# Altium schematic sheet Power Distribution - Load Switchs and Connectos.SchDoc: Title
size B; Organization: Midnight Sun Solar Rayce Car Team; Address1: University of Waterloo; Address2: 200 University Ave W; Address3: Waterloo, ON, Canada; Address4: N2L 3E9; Website: www.uwmidsun.com; ProjectName: ProjectName
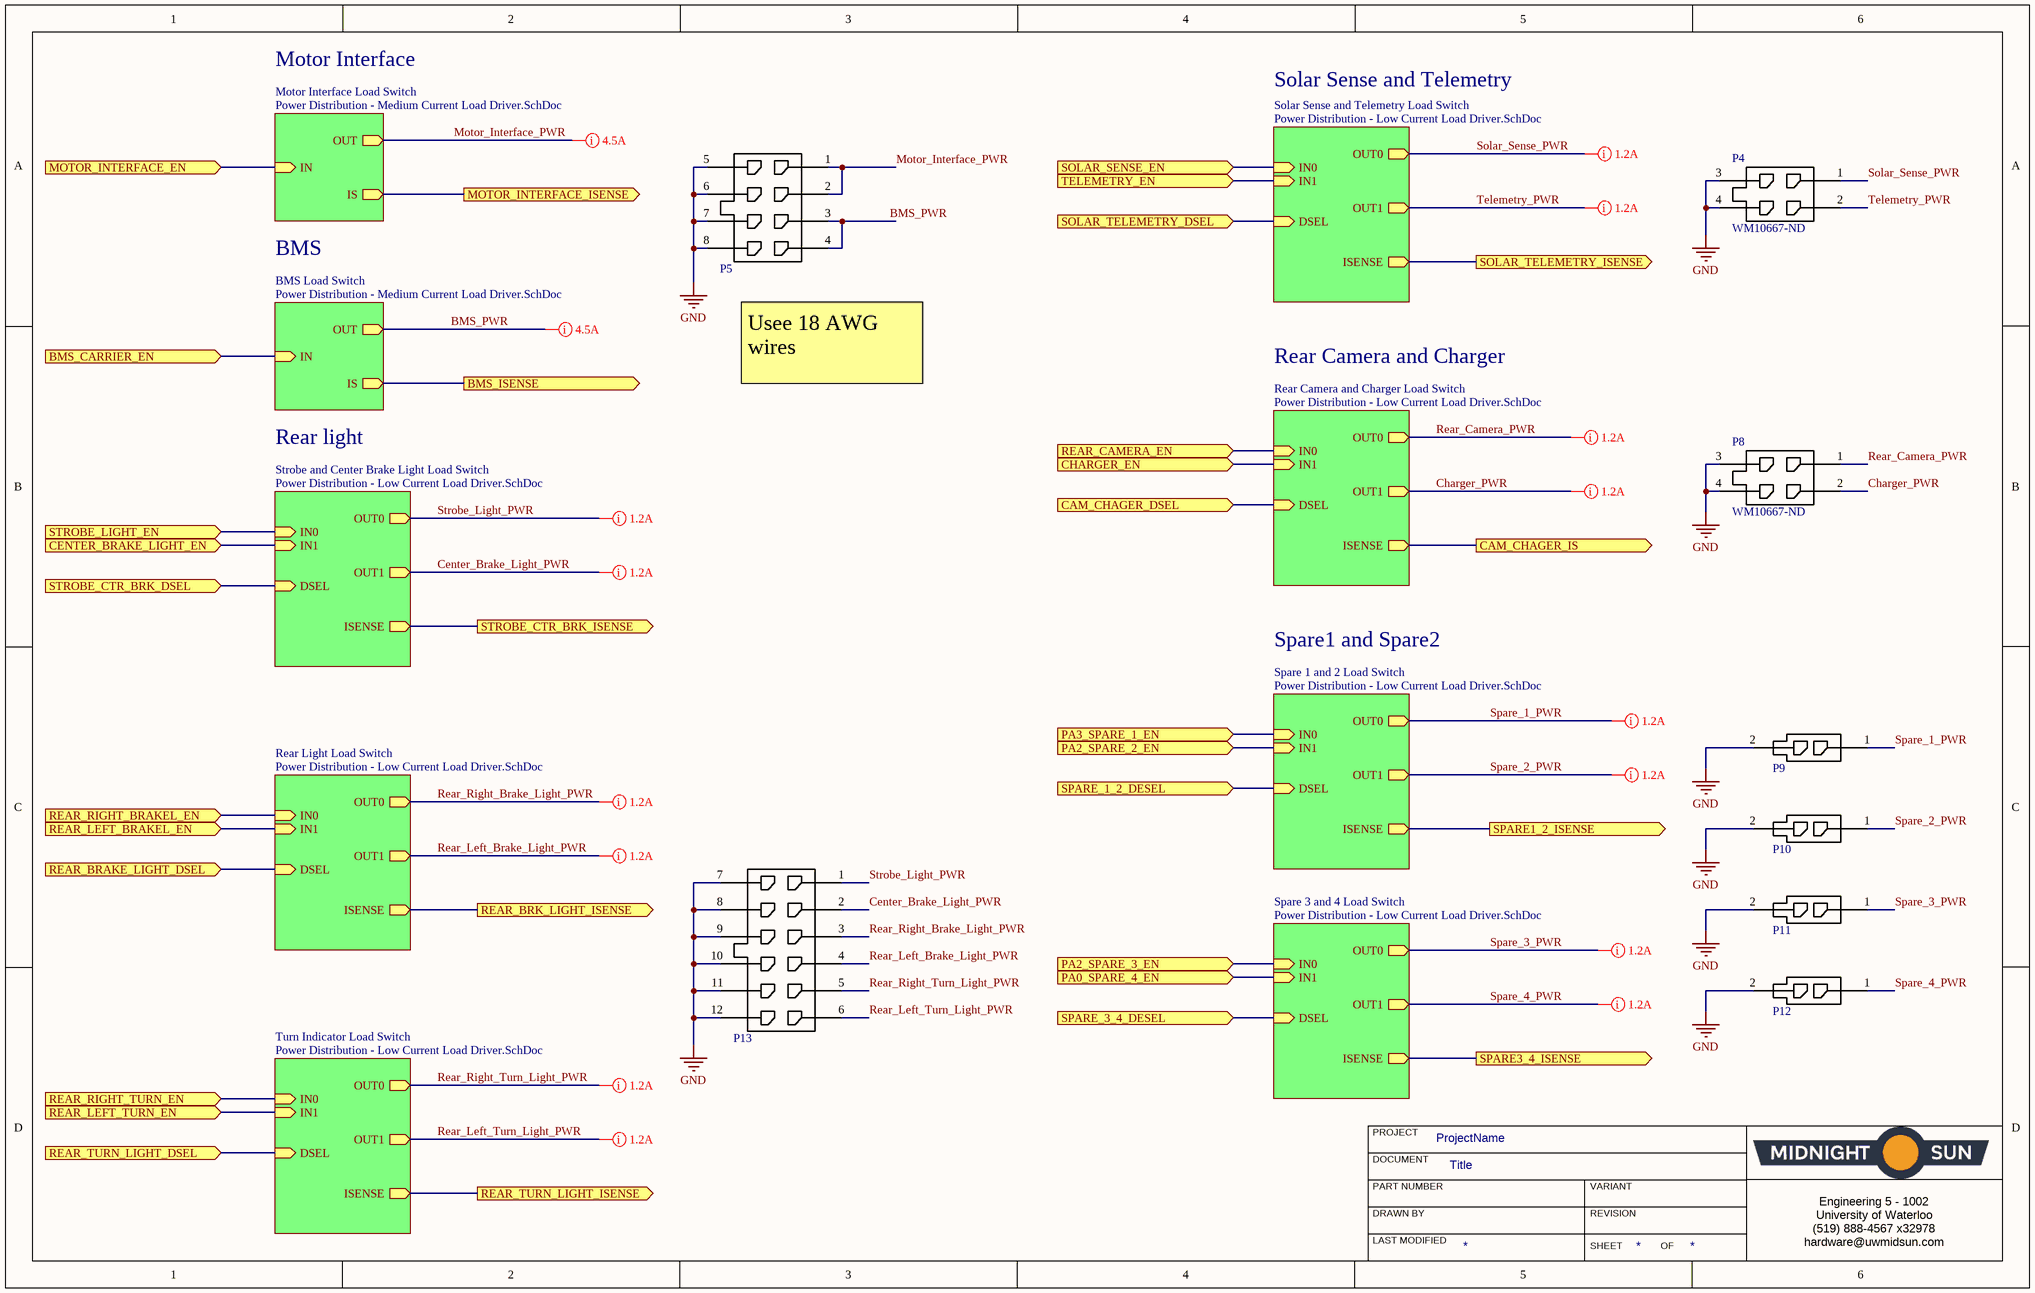
[diagram p0: Power Distribution - Load Switchs and Connectos.SchDoc]

## Parts
P4  Supplier Part Number 1: WM10667-ND  [CONN 4POS MICROFIT (2x2)]  (hidden comment: CONN 4POS MICRO-FIT 3mm)
P5  CONN 8POS MICRO-FIT 3mm  [CONN, 8POS MICRO-FIT]  (value not drawn)
P8  Supplier Part Number 1: WM10667-ND  [CONN 4POS MICROFIT (2x2)]  (hidden comment: CONN 4POS MICRO-FIT 3mm)
P9  CONN 2POS MICRO-FIT 3mm  [CONN, 2POS MICRO-FIT]  (value not drawn)
P10  CONN 2POS MICRO-FIT 3mm  [CONN, 2POS MICRO-FIT]  (value not drawn)
P11  CONN 2POS MICRO-FIT 3mm  [CONN, 2POS MICRO-FIT]  (value not drawn)
P12  CONN 2POS MICRO-FIT 3mm  [CONN, 2POS MICRO-FIT]  (value not drawn)
P13  CONN 12POS MICRO-FIT 3mm  [CONN, 12POS MICRO-FIT 3mm]  (value not drawn)

## Sub-sheets
BMS Load Switch = Power Distribution - Medium Current Load Driver.SchDoc: IN (in), IS (out), OUT (out)
Motor Interface Load Switch = Power Distribution - Medium Current Load Driver.SchDoc: IN (in), IS (out), OUT (out)
Rear Camera and Charger Load Switch = Power Distribution - Low Current Load Driver.SchDoc: IN0 (in), IN1 (in), DSEL (in), ISENSE (out), OUT0 (out), OUT1 (out)
Rear Light Load Switch = Power Distribution - Low Current Load Driver.SchDoc: IN0 (in), IN1 (in), DSEL (in), ISENSE (out), OUT0 (out), OUT1 (out)
Solar Sense and Telemetry Load Switch = Power Distribution - Low Current Load Driver.SchDoc: IN0 (in), IN1 (in), DSEL (in), ISENSE (out), OUT0 (out), OUT1 (out)
Spare 1 and 2 Load Switch = Power Distribution - Low Current Load Driver.SchDoc: IN0 (in), IN1 (in), DSEL (in), ISENSE (out), OUT0 (out), OUT1 (out)
Spare 3 and 4 Load Switch = Power Distribution - Low Current Load Driver.SchDoc: IN0 (in), IN1 (in), DSEL (in), ISENSE (out), OUT0 (out), OUT1 (out)
Strobe and Center Brake Light Load Switch = Power Distribution - Low Current Load Driver.SchDoc: IN0 (in), IN1 (in), DSEL (in), ISENSE (out), OUT0 (out), OUT1 (out)
Turn Indicator Load Switch = Power Distribution - Low Current Load Driver.SchDoc: IN0 (in), IN1 (in), DSEL (in), ISENSE (out), OUT0 (out), OUT1 (out)

## Ports
BMS_CARRIER_EN (in), BMS_ISENSE (out), CAM_CHAGER_DSEL (in), CAM_CHAGER_IS (out), CENTER_BRAKE_LIGHT_EN (in), CHARGER_EN (in), MOTOR_INTERFACE_EN (in), MOTOR_INTERFACE_ISENSE (out), PA0_SPARE_4_EN (in), PA2_SPARE_2_EN (in), PA2_SPARE_3_EN (in), PA3_SPARE_1_EN (in), REAR_BRAKE_LIGHT_DSEL (in), REAR_BRK_LIGHT_ISENSE (out), REAR_CAMERA_EN (in), REAR_LEFT_BRAKEL_EN (in), REAR_LEFT_TURN_EN (in), REAR_RIGHT_BRAKEL_EN (in), REAR_RIGHT_TURN_EN (in), REAR_TURN_LIGHT_DSEL (in), REAR_TURN_LIGHT_ISENSE (out), SOLAR_SENSE_EN (in), SOLAR_TELEMETRY_DSEL (in), SOLAR_TELEMETRY_ISENSE (out), SPARE1_2_ISENSE (out), SPARE3_4_ISENSE (out), SPARE_1_2_DESEL (in), SPARE_3_4_DESEL (in), STROBE_CTR_BRK_DSEL (in), STROBE_CTR_BRK_ISENSE (out), STROBE_LIGHT_EN (in), TELEMETRY_EN (in)

## Nets
GND: P4.3 P4.4 P5.5 P5.6 P5.7 P5.8 P8.3 P8.4 P9.2 P10.2 P11.2 P12.2 P13.7 P13.8 P13.9 P13.10 P13.11 P13.12
BMS_CARRIER_EN: port BMS_CARRIER_EN, sheet BMS Load Switch/IN
BMS_ISENSE: port BMS_ISENSE, sheet BMS Load Switch/IS
BMS_PWR: P5.3 P5.4 ; sheet BMS Load Switch/OUT
CAM_CHAGER_DSEL: port CAM_CHAGER_DSEL, sheet Rear Camera and Charger Load Switch/DSEL
CAM_CHAGER_IS: port CAM_CHAGER_IS, sheet Rear Camera and Charger Load Switch/ISENSE
CENTER_BRAKE_LIGHT_EN: port CENTER_BRAKE_LIGHT_EN, sheet Strobe and Center Brake Light Load Switch/IN1
Center_Brake_Light_PWR: P13.2 ; sheet Strobe and Center Brake Light Load Switch/OUT1
CHARGER_EN: port CHARGER_EN, sheet Rear Camera and Charger Load Switch/IN1
Charger_PWR: P8.2 ; sheet Rear Camera and Charger Load Switch/OUT1
MOTOR_INTERFACE_EN: port MOTOR_INTERFACE_EN, sheet Motor Interface Load Switch/IN
MOTOR_INTERFACE_ISENSE: port MOTOR_INTERFACE_ISENSE, sheet Motor Interface Load Switch/IS
Motor_Interface_PWR: P5.1 P5.2 ; sheet Motor Interface Load Switch/OUT
PA0_SPARE_4_EN: port PA0_SPARE_4_EN, sheet Spare 3 and 4 Load Switch/IN1
PA2_SPARE_2_EN: port PA2_SPARE_2_EN, sheet Spare 1 and 2 Load Switch/IN1
PA2_SPARE_3_EN: port PA2_SPARE_3_EN, sheet Spare 3 and 4 Load Switch/IN0
PA3_SPARE_1_EN: port PA3_SPARE_1_EN, sheet Spare 1 and 2 Load Switch/IN0
REAR_BRAKE_LIGHT_DSEL: port REAR_BRAKE_LIGHT_DSEL, sheet Rear Light Load Switch/DSEL
REAR_BRK_LIGHT_ISENSE: port REAR_BRK_LIGHT_ISENSE, sheet Rear Light Load Switch/ISENSE
REAR_CAMERA_EN: port REAR_CAMERA_EN, sheet Rear Camera and Charger Load Switch/IN0
Rear_Camera_PWR: P8.1 ; sheet Rear Camera and Charger Load Switch/OUT0
Rear_Left_Brake_Light_PWR: P13.4 ; sheet Rear Light Load Switch/OUT1
REAR_LEFT_BRAKEL_EN: port REAR_LEFT_BRAKEL_EN, sheet Rear Light Load Switch/IN1
REAR_LEFT_TURN_EN: port REAR_LEFT_TURN_EN, sheet Turn Indicator Load Switch/IN1
Rear_Left_Turn_Light_PWR: P13.6 ; sheet Turn Indicator Load Switch/OUT1
Rear_Right_Brake_Light_PWR: P13.3 ; sheet Rear Light Load Switch/OUT0
REAR_RIGHT_BRAKEL_EN: port REAR_RIGHT_BRAKEL_EN, sheet Rear Light Load Switch/IN0
REAR_RIGHT_TURN_EN: port REAR_RIGHT_TURN_EN, sheet Turn Indicator Load Switch/IN0
Rear_Right_Turn_Light_PWR: P13.5 ; sheet Turn Indicator Load Switch/OUT0
REAR_TURN_LIGHT_DSEL: port REAR_TURN_LIGHT_DSEL, sheet Turn Indicator Load Switch/DSEL
REAR_TURN_LIGHT_ISENSE: port REAR_TURN_LIGHT_ISENSE, sheet Turn Indicator Load Switch/ISENSE
SOLAR_SENSE_EN: port SOLAR_SENSE_EN, sheet Solar Sense and Telemetry Load Switch/IN0
Solar_Sense_PWR: P4.1 ; sheet Solar Sense and Telemetry Load Switch/OUT0
SOLAR_TELEMETRY_DSEL: port SOLAR_TELEMETRY_DSEL, sheet Solar Sense and Telemetry Load Switch/DSEL
SOLAR_TELEMETRY_ISENSE: port SOLAR_TELEMETRY_ISENSE, sheet Solar Sense and Telemetry Load Switch/ISENSE
SPARE1_2_ISENSE: port SPARE1_2_ISENSE, sheet Spare 1 and 2 Load Switch/ISENSE
SPARE3_4_ISENSE: port SPARE3_4_ISENSE, sheet Spare 3 and 4 Load Switch/ISENSE
SPARE_1_2_DESEL: port SPARE_1_2_DESEL, sheet Spare 1 and 2 Load Switch/DSEL
Spare_1_PWR: P9.1 ; sheet Spare 1 and 2 Load Switch/OUT0
Spare_2_PWR: P10.1 ; sheet Spare 1 and 2 Load Switch/OUT1
SPARE_3_4_DESEL: port SPARE_3_4_DESEL, sheet Spare 3 and 4 Load Switch/DSEL
Spare_3_PWR: P11.1 ; sheet Spare 3 and 4 Load Switch/OUT0
Spare_4_PWR: P12.1 ; sheet Spare 3 and 4 Load Switch/OUT1
STROBE_CTR_BRK_DSEL: port STROBE_CTR_BRK_DSEL, sheet Strobe and Center Brake Light Load Switch/DSEL
STROBE_CTR_BRK_ISENSE: port STROBE_CTR_BRK_ISENSE, sheet Strobe and Center Brake Light Load Switch/ISENSE
STROBE_LIGHT_EN: port STROBE_LIGHT_EN, sheet Strobe and Center Brake Light Load Switch/IN0
Strobe_Light_PWR: P13.1 ; sheet Strobe and Center Brake Light Load Switch/OUT0
TELEMETRY_EN: port TELEMETRY_EN, sheet Solar Sense and Telemetry Load Switch/IN1
Telemetry_PWR: P4.2 ; sheet Solar Sense and Telemetry Load Switch/OUT1

## Layout directives
mark named 4.5A: BMS_PWR, Motor_Interface_PWR
mark named 1.2A: Center_Brake_Light_PWR, Charger_PWR, Rear_Camera_PWR, Rear_Left_Brake_Light_PWR, Rear_Left_Turn_Light_PWR, Rear_Right_Brake_Light_PWR, Rear_Right_Turn_Light_PWR, Solar_Sense_PWR, Spare_1_PWR, Spare_2_PWR, Spare_3_PWR, Spare_4_PWR, Strobe_Light_PWR, Telemetry_PWR

## Notes on the sheet
- Motor Interface
- Solar Sense and Telemetry
- BMS
- Rear Camera and Charger
- Usee 18 AWG wires
- Rear light
- Spare1 and Spare2
- PROJECT
- DOCUMENT
- DRAWN BY
- LAST MODIFIED
- PART NUMBER
- REVISION
- SHEET
- VARIANT
- OF
- Engineering 5 - 1002
  University of Waterloo
  (519) 888-4567 x32978
  hardware@uwmidsun.com

## Library data of the parts
P4 P8 = CONN 4POS MICRO-FIT 3mm: Micro-Fit 3.0 Vertical Header, 3.00mm Pitch, Dual Row, 4 Circuits, with PCB Polarizing Peg, Tin, Glow-Wire Capable, Black; Manufacturer: Molex, LLC; Manufacturer Part Number: 430450427; Pitch - Mating: 0.118" (3.00mm); Number of Positions: 6; Number of Positions Loaded: All; Style: Board to Cable/Wire; Shrouding: Shrouded - 4 Wall; Contact Length - Post: 0.125" (3.18mm); Material Flammability Rating: UL94 V-0; Contact Resistance: 10mR; Number of Contacts: 4; Number of Ports: 1; Row Spacing: 0.118inch; RoHS: RoHS Compliant; Category: Connectors, Interconnects; Packaging: Tray; Part Status: Active; Connector Type: Header; Contact Type: Male Pin; Number of Rows: 2; Row Spacing - Mating: 0.118" (3.00mm); Mounting Type: Through Hole; Termination: Solder; Fastening Type: Locking Ramp; Contact Length - Mating: -; Overall Contact Length: -; Insulation Height: 0.390" (9.91mm); Contact Shape: Square; Contact Finish - Mating: Tin; Contact Finish Thickness - Mating: 60.0µin (1.52µm); Contact Finish - Post: Tin; Contact Material: Brass; Insulation Material: Liquid Crystal Polymer (LCP), Glass Filled; Features: Board Guide; Operating Temperature: -; Ingress Protection: -; Insulation Color: Black; Current Rating: -; Voltage Rating: -; Mated Stacking Heights: -; Contact Finish Thickness - Post: -; Applications: General Purpose, Medical, Military, Telecommunications; Mount: Through Hole; Contact Plating: Tin; Housing Material: Polymer; Color: Black; Number of Terminals: 4; Housing Color: Black; Min Operating Temperature: -40°C; Max Operating Temperature: 105°C; Package Quantity: 2232; Orientation: Straight; Length: 10.15mm; Pitch: 3mm; Depth: 8.77mm; ComponentLink4URL: http://www.molex.com/webdocs/datasheets/pdf/en-us/0430450427_PCB_HEADERS.pdf; ComponentLink4Description: http://www.molex.com/webdocs/datasheets/pdf/en-us/0430450427_PCB_HEADERS.pdf; Supplier 1: Digi-Key
P5 = CONN 8POS MICRO-FIT 3mm: Connector Header Through Hole 6 position 0.118" (3.00mm); Manufacturer: Molex, LLC; Manufacturer Part Number: 0430450827; Number of Positions: 6; Number of Positions Loaded: All; Style: Board to Cable/Wire; Shrouding: Shrouded - 4 Wall; Contact Length - Post: 0.125" (3.18mm); Material Flammability Rating: UL94 V-0; RoHS: RoHS Compliant; Category: Connectors, Interconnects; Packaging: Tray; Part Status: Active; Connector Type: Header; Contact Type: Male Pin; Pitch - Mating: 0.118" (3.00mm); Number of Rows: 2; Row Spacing - Mating: 0.118" (3.00mm); Mounting Type: Through Hole; Termination: Solder; Fastening Type: Locking Ramp; Contact Length - Mating: -; Overall Contact Length: -; Insulation Height: 0.390" (9.91mm); Contact Shape: Square; Contact Finish - Mating: Tin; Contact Finish Thickness - Mating: 60.0µin (1.52µm); Contact Finish - Post: Tin; Contact Material: Brass; Insulation Material: Liquid Crystal Polymer (LCP), Glass Filled; Features: Board Guide; Operating Temperature: -; Ingress Protection: -; Insulation Color: Black; Current Rating: -; Voltage Rating: -; Mated Stacking Heights: -; Contact Finish Thickness - Post: -; Applications: General Purpose, Medical, Military, Telecommunications; Supplier 1: Digi-Key; Stock 1: 5553; Pricing 1: 1=2.69, 10=2.445, 25=2.2964, 50=2.1964, 100=2.0965, 250=1.8968, 500=1.74704, 1440=1.49746, 2880=1.39763 (CAD); Supplier Part Number 1: WM10684-ND; ComponentLink1Description: https://www.molex.com/pdm_docs/ps/PS-43045.pdf; ComponentLink1URL: https://www.molex.com/pdm_docs/ps/PS-43045.pdf; ComponentLink2Description: https://www.molex.com/webdocs/datasheets/pdf/en-us/0430450827_PCB_HEADERS.pdf; ComponentLink2URL: https://www.molex.com/webdocs/datasheets/pdf/en-us/0430450827_PCB_HEADERS.pdf
P9-P12 = CONN 2POS MICRO-FIT 3mm: Connector Header Through Hole 2 position; Manufacturer: Molex; Manufacturer Part Number: 43045-0227; Number of Positions: 2; Gender: Male; Contact Resistance: 10mR; Number of Ports: 1; Max Voltage Rating (DC): 250.25kV; Current Rating: 5A; Voltage Rating: 600V; Glow Wire Compliant: Compliant; Supplier 1: Digi-Key; Stock 1: 3657; Pricing 1: 1=0.84, 10=0.74, 25=0.6968, 50=0.6676, 100=0.6387, 250=0.5806, 500=0.52254, 1000=0.46448, 2500=0.42094 (USD); Mount: Through Hole; Contact Plating: Tin; Contact Material: Brass; Housing Colour: Black; Housing Material: Thermoplastic; Number of Terminals: 2; Min Operating Temperature: -40°C; Max Operating Temperature: 105°C; Number of Rows: 2; Packaging: Tray; Termination: Solder; Number of Contacts: 2; Orientation: Vertical; Package Quantity: 3168; Number of Circuits: 2; Length: 7.15mm; Pitch: 3mm; Depth: 8.77mm; Row Spacing: 3mm; Radiation Hardening: No; Halogen Free: Low Halogen; ComponentLink1URL: http://www.onlinecomponents.com/productFiles/mf-MOL/307170430450227_pcb_headers.pdf; ComponentLink1Description: http://www.onlinecomponents.com/productFiles/mf-MOL/307170430450227_pcb_headers.pdf; ComponentLink2URL: http://www.mouser.com/ds/2/276/0430450227_PCB_HEADERS-142611.pdf; ComponentLink2Description: http://www.mouser.com/ds/2/276/0430450227_PCB_HEADERS-142611.pdf; ComponentLink3URL: http://uk.rs-online.com/webdocs/13c3/0900766b813c3a46.pdf; ComponentLink3Description: http://uk.rs-online.com/webdocs/13c3/0900766b813c3a46.pdf; ComponentLink4URL: http://www.molex.com/webdocs/datasheets/pdf/en-us/0430450227_PCB_HEADERS.pdf; ComponentLink4Description: http://www.molex.com/webdocs/datasheets/pdf/en-us/0430450227_PCB_HEADERS.pdf; Supplier Part Number 1: WM10657-ND
P13 = CONN 12POS MICRO-FIT 3mm: Connector Header Through Hole 12 position 0.118" (3.00mm); Manufacturer: Molex, LLC; Manufacturer Part Number: 0430451227; Number of Positions: 12; Number of Positions Loaded: All; Style: Board to Cable/Wire; Shrouding: Shrouded - 4 Wall; Contact Length - Post: 0.125" (3.18mm); Material Flammability Rating: UL94 V-0; Supplier 1: Digi-Key; RoHS: RoHS Compliant; Category: Connectors, Interconnects; Stock 1: 1709; Pricing 1: 1=3.61, 10=3.283, 25=3.0816, 50=2.9478, 100=2.8138, 250=2.5458, 500=2.34482, 1008=2.00985, 3024=1.87586 (CAD); Packaging: Tray; Part Status: Active; Connector Type: Header; Contact Type: Male Pin; Pitch - Mating: 0.118" (3.00mm); Number of Rows: 2; Row Spacing - Mating: 0.118" (3.00mm); Mounting Type: Through Hole; Termination: Solder; Fastening Type: Locking Ramp; Contact Length - Mating: -; Overall Contact Length: -; Insulation Height: 0.390" (9.91mm); Contact Shape: Square; Contact Finish - Mating: Tin; Contact Finish Thickness - Mating: 60.0µin (1.52µm); Contact Finish - Post: Tin; Contact Material: Brass; Insulation Material: Liquid Crystal Polymer (LCP), Glass Filled; Features: Board Guide; Operating Temperature: -; Ingress Protection: -; Insulation Color: Black; Current Rating: -; Voltage Rating: -; Mated Stacking Heights: -; Contact Finish Thickness - Post: -; Applications: General Purpose, Medical, Military, Telecommunications; ComponentLink1URL: https://www.molex.com/pdm_docs/sd/430451227_sd.pdf; ComponentLink1Description: https://www.molex.com/pdm_docs/sd/430451227_sd.pdf; Supplier Part Number 1: WM10697-ND